# Altium schematic sheet 1_PWR.SchDoc: SmartHalo - Power Supply
size B; Author: Sébastien Gélinas; Organization: SmartHalo; Address1: 5445 de Gaspé; Address2: Montréal, QC; Address3: Canada; Address4: H2T 3B2; DocumentNumber: 1; Revision: 1; SheetNumber: 1; SheetTotal: 7
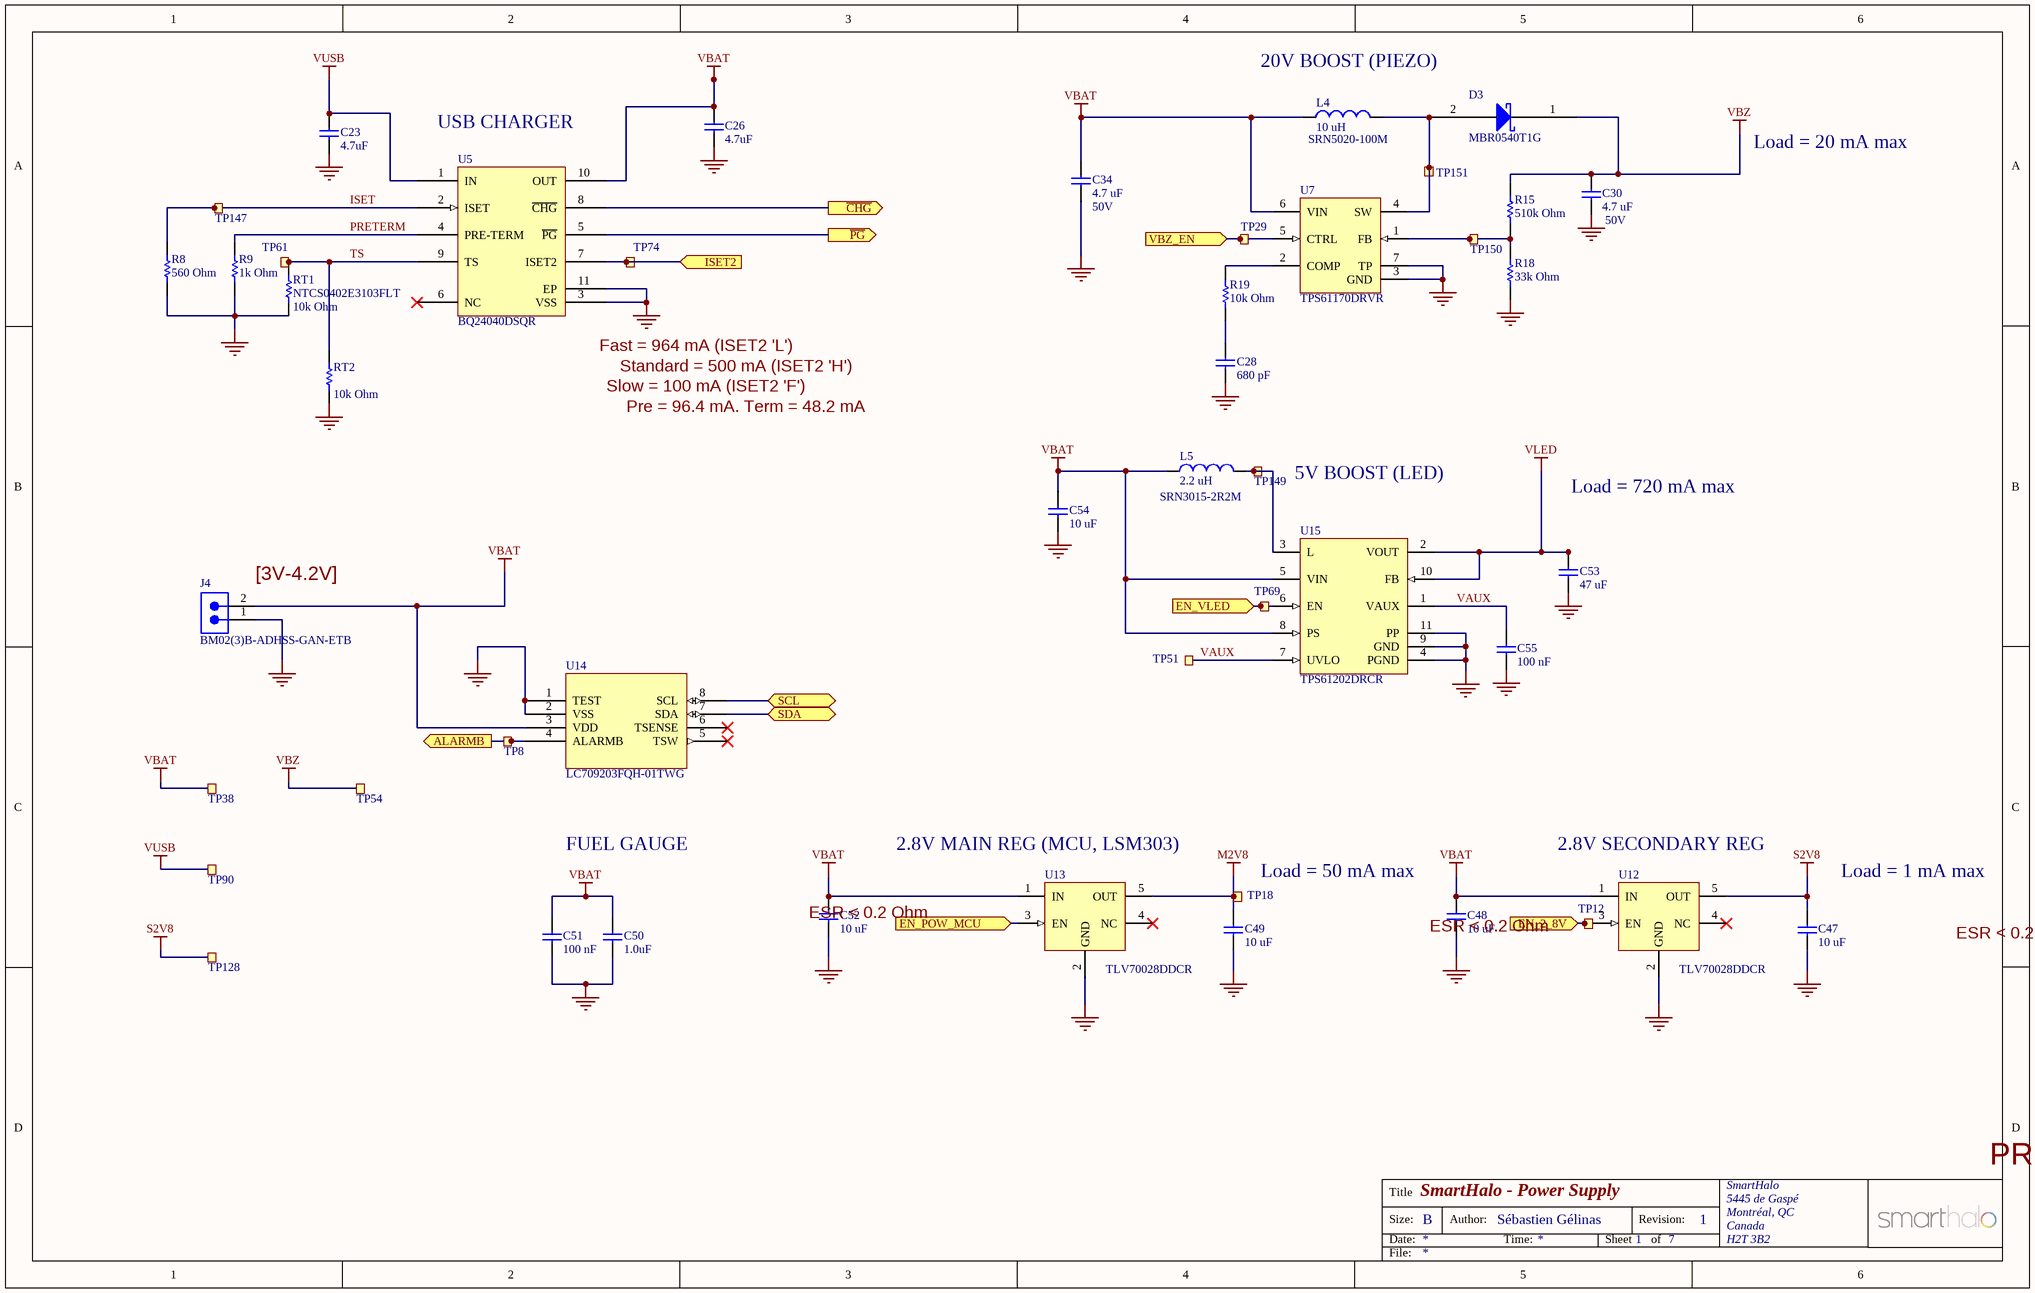
[diagram p0: 1_PWR.SchDoc]

## Parts
C23  4.7uF  [Varitron_CAP0603]
C26  4.7uF  [Varitron_CAP0603]
C28  680 pF  [Varitron_CAP0402]
C30  4.7 uF  Voltage Rating: 50V  [Varitron_CAP0805]
C34  4.7 uF  Voltage Rating: 50V  [Varitron_CAP0805]
C47  10 uF  [Varitron_CAP0805]
C48  10 uF  [Varitron_CAP0805]
C49  10 uF  [Varitron_CAP0805]
C50  1.0uF  [Varitron_CAP0603]
C51  100 nF  [Varitron_CAP0402]
C52  10 uF  [Varitron_CAP0805]
C53  47 uF  [Varitron_CAP1206]
C54  10 uF  [Varitron_CAP0805]
C55  100 nF  [Varitron_CAP0402]
D3  MBR0540T1G  [ONSC-SOD-123-2-425-04_V]
J4  BM02(3)B-ADHSS-GAN-ETB  [BM02(3)B-ADHSS-GAN-ETB]
L4  10 uH  [SRN5020-100M]
L5  2.2 uH  [SRN3015-2R2M]
R8  560 Ohm  [Varitron_RES0402]
R9  1k Ohm  [Varitron_RES0402]
R15  510k Ohm  [Varitron_RES0402]
R18  33k Ohm  [Varitron_RES0402]
R19  10k Ohm  [Varitron_RES0402]
RT1  NTCS0402E3103FLT  value 10k Ohm  [Varitron_RES0402]
RT2  value 10k Ohm  [THERMISTOR_TH]  (no BOM)
TP8  (no value)  [TESTPAD-TH-35mils]  (no BOM)
TP12  (no value)  [TESTPAD-TH-35mils]  (no BOM)
TP18  (no value)  [TESTPAD-TH-1_5mm]  (no BOM)
TP29  (no value)  [TESTPAD-TH-35mils]  (no BOM)
TP38  (no value)  [TESTPAD-TH-35mils]  (no BOM)
TP51  (no value)  [TESTPAD-TH-35mils]  (no BOM)
TP54  (no value)  [TESTPAD-TH-35mils]  (no BOM)
TP61  (no value)  [TESTPAD-TH-35mils]  (no BOM)
TP69  (no value)  [TESTPAD-TH-35mils]  (no BOM)
TP74  (no value)  [TESTPAD-TH-35mils]  (no BOM)
TP90  (no value)  [TESTPAD-TH-35mils]  (no BOM)
TP128  (no value)  [TESTPAD-TH-1_5mm]  (no BOM)
TP147  TP  [TESTPAD-TH-35mils]  (value not drawn)  (no BOM)
TP149  TP  [TESTPAD-TH-35mils]  (value not drawn)  (no BOM)
TP150  TP  [TESTPAD-TH-35mils]  (value not drawn)  (no BOM)
TP151  TP  [TESTPAD-TH-35mils]  (value not drawn)  (no BOM)
U5  BQ24040DSQR  [DSQ10-1500X900TP]
U7  TPS61170DRVR  [DRV6-1600X1000TP]
U12  TLV70028DDCR  [SOT23-5_N]
U13  TLV70028DDCR  [SOT23-5_N]
U14  LC709203FQH-01TWG  [WDFN8]
U15  TPS61202DRCR  [DRC10-2400X1650TP]

## Ports
ALARMB (out), EN_2_8V (in), EN_POW_MCU (in), EN_VLED (in), ISET2 (in), SCL (bidir), SDA (bidir), VBZ_EN (in), ~{CHG} (out), ~{PG} (out)

## Nets
GND: C23.2 C26.2 C28.2 C30.2 C34.2 C47.2 C48.2 C49.2 C50.2 C51.2 C52.2 C53.2 C54.2 C55.2 J4.0(ASSY) J4.1 R8.2 R9.2 R18.1 RT1.1 RT2.1 U5.3(VSS) U5.11(EP) U7.3(GND) U7.7(TP) U12.2(GND) U13.2(GND) U14.1(TEST) U14.2(VSS) U15.4(PGND) U15.9(GND) U15.11(PP)
M2V8: C49.1 TP18.1 U13.5(OUT)
S2V8: C47.1 TP128.1 U12.5(OUT)
VBAT: C26.1 C34.1 C48.1 C50.1 C51.1 C52.1 C54.1 J4.2 L4.1 L5.1 TP38.1 U5.10(OUT) U7.6(VIN) U12.1(IN) U13.1(IN) U14.3(VDD) U15.5(VIN) U15.8(PS)
VBZ: C30.1 D3.1(Cathode) R15.2 TP54.1
VLED: C53.1 U15.2(VOUT) U15.10(FB)
VUSB: C23.1 TP90.1 U5.1(IN)
ALARMB: TP8.1 U14.4(ALARMB) ; port ALARMB
~{CHG}: U5.8(~{CHG}) ; port ~{CHG}
EN_2_8V: TP12.1 U12.3(EN) ; port EN_2_8V
EN_POW_MCU: U13.3(EN) ; port EN_POW_MCU
EN_VLED: TP69.1 U15.6(EN) ; port EN_VLED
ISET: R8.1 TP147.1 U5.2(ISET)
ISET2: TP74.1 U5.7(ISET2) ; port ISET2
~{PG}: U5.5(~{PG}) ; port ~{PG}
PRETERM: R9.1 U5.4(PRE-TERM)
SCL: U14.8(SCL) ; port SCL
SDA: U14.7(SDA) ; port SDA
TS: RT1.2 RT2.2 TP61.1 U5.9(TS)
VAUX: C55.1 TP51.1 U15.1(VAUX) U15.7(UVLO)
VBZ_EN: TP29.1 U7.5(CTRL) ; port VBZ_EN
NetC28_1: C28.1 R19.2
NetD3_2: D3.2(Anode) L4.2 TP151.1 U7.4(SW)
NetL5_2: L5.2 TP149.1 U15.3(L)
NetR15_1: R15.1 R18.2 TP150.1 U7.1(FB)
NetR19_1: R19.1 U7.2(COMP)

Not connected (* = marked no-connect by the designer): U5 6(NC)*; U12 4(NC)*; U13 4(NC)*; U14 5(TSW)* 6(TSENSE)*

## Notes on the sheet
- 20V BOOST (PIEZO)
- (near U5) USB CHARGER
- Load = 20 mA max
- (near U5) Fast = 964 mA (ISET2 'L')
- Standard = 500 mA (ISET2 'H')
- Slow = 100 mA (ISET2 'F')
- (near RT2) Pre = 96.4 mA. Term = 48.2 mA
- 5V BOOST (LED)
- Load = 720 mA max
- (near J4) [3V-4.2V]
- FUEL GAUGE
- (near U13) 2.8V MAIN REG (MCU, LSM303)
- (near TP18) Load = 50 mA max
- (near U12) 2.8V SECONDARY REG
- Load = 1 mA max
- (near C52) ESR < 0.2 Ohm
- (near C48) ESR < 0.2 Ohm
- (near C47) ESR < 0.2 Ohm
- PRELIMINARY: DO NOT USE FOR PRODUCTION
- Title
- Size:
- Date:
- B
- Author:
- Time:
- Sheet
- Revision:
- of
- File:

## Library data of the parts
C23 C26 = Varitron_CAP0603: 4.7uF 10V X7R 10% 0603 (1608 Metric)  SMD; Case-EIA: 0603; Case-Metric: 1608; Tolerance: 10%; Technology: SMT; Temperature Coefficient: X7R; Voltage Rating: 10V; Value: 4.7uF
C28 = Varitron_CAP0402: 680 pF 10V X7R 10% 0402 (1005 Metric)  SMD; Case-EIA: 0402; Case-Metric: 1005; Tolerance: 10%; Technology: SMT; Temperature Coefficient: X7R; Voltage Rating: 10V; Value: 680 pF
C30 C34 = Varitron_CAP0805: 4.7 uF 50V X5R 10% 0805 (2012 Metric)  SMD; Case-EIA: 0805; Case-Metric: 2012; Tolerance: 10%; Technology: SMT; Temperature Coefficient: X5R; Value: 4.7 uF
C47-C49 C52 C54 = Varitron_CAP0805: 10 uF 10V X7R 10% 0805 (2012 Metric)  SMD; Case-EIA: 0805; Case-Metric: 2012; Tolerance: 10%; Technology: SMT; Temperature Coefficient: X7R; Voltage Rating: 10V; Value: 10 uF
C50 = Varitron_CAP0603: 1uF 10V X7R 10% 0603 (1608 Metric)  SMD; Case-EIA: 0603; Case-Metric: 1608; Tolerance: 10%; Technology: SMT; Temperature Coefficient: X7R; Voltage Rating: 10V; Value: 1.0uF
C51 C55 = Varitron_CAP0402: 100 nF 10V X7R 10% 0402 (1005 Metric)  SMD; Case-EIA: 0402; Case-Metric: 1005; Tolerance: 10%; Technology: SMT; Temperature Coefficient: X7R; Voltage Rating: 10V; Value: 100 nF
C53 = Varitron_CAP1206: 47 uF 10V X5R 10% 1206 (3216 Metric)  SMD; Case-EIA: 1206; Case-Metric: 3216; Tolerance: 10%; Technology: SMT; Temperature Coefficient: X5R; Voltage Rating: 10V; Value: 47 uF
D3 = MBR0540T1G: Schottky Power Rectifier, 2-Pin SOD-123, Pb-Free, Tape and Reel; Manufacturer: ON Semiconductor; Manufacturer Part Number: MBR0540T1G; Part Number: MBR0540T1G
J4 = BM02(3)B-ADHSS-GAN-ETB: Connector, 1.3 mm pitch; Manufacturer: JST; Manufacturer Part Number: BM02(3)B-ADHSS-GAN-ETB; Part Number: BM02(3)B-ADHSS-GAN-ETB
L4 = SRN5020-100M: Inductor, 10 uH, 20%, 144 mOhm DCR, 1.3A; Manufacturer: Bourns; Manufacturer Part Number: SRN5020-100M; Part Number: SRN5020-100M; Value: 10 uH; Tolerance: 20%; DCR: 144 mOhm; Saturation Current: 1.3A
L5 = SRN3015-2R2M: Inductor, 2.2 uH, 20%, 72 mOhm DCR, 1.65A; Manufacturer: Bourns; DCR: 72 mOhm; Manufacturer Part Number: SRN3015-2R2M; Part Number: SRN3015-2R2M; Value: 2.2 uH; Tolerance: 20%; Saturation Current: 1.65A
R8 = Varitron_RES0402: 560R 0.063W 5% 0402 (1005 Metric) SMD; Case-Metric: 1005; Case-EIA: 0402; Tolerance: 5%; Technology: SMT; Power: 0.063W; Value: 560 Ohm
R9 = Varitron_RES0402: 1K 0.063W 5%  0402 (1005 Metric)  SMD; Case-Metric: 1005; Case-EIA: 0402; Tolerance: 5%; Technology: SMT; Power: 0.063W; Value: 1k Ohm
R15 = Varitron_RES0402: 510K 0.063W 5% 0402 (1005 Metric)  SMD; Case-Metric: 1005; Case-EIA: 0402; Tolerance: 5%; Technology: SMT; Power: 0.063W; Value: 510k Ohm
R18 = Varitron_RES0402: 33K 0.063W 5%  0402 (1005 Metric)  SMD; Case-Metric: 1005; Case-EIA: 0402; Tolerance: 5%; Technology: SMT; Power: 0.063W; Value: 33k Ohm
R19 = Varitron_RES0402: 10K 0.063W 5% 0402 (1005 Metric)  SMD; Case-Metric: 1005; Case-EIA: 0402; Tolerance: 5%; Technology: SMT; Power: 0.063W; Value: 10k Ohm
RT1 = NTCS0402E3103FLT: Thermistor NTC 0402, R0 10k, 1%, B 3490, SMD; Manufacturer: Vishay; Case-Metric: 1005; Case-EIA: 0402; Beta: 3490; Tolerance: 1%; Technology: SMT; Part Number: NTCS0402E3103FLT; Manufacturer Part Number: NTCS0402E3103FLT
RT2 = THERMISTOR_TH: Thermistor NTC TH, R0 10k, 1%, B , TH; Tolerance: 1%; Technology: TH
TP8 TP12 TP29 TP38 TP51 TP54 TP61 TP69 TP74 TP90 = TESTPAD_TH_35mils: Testpoint, through hole, 35 mils; Value: TP
TP18 TP128 = TESTPAD_TH_1_5MM: Testpoint, through hole, 1.5mm; Value: TP
TP147 TP149-TP151 = TESTPAD_TH_35mils: Testpoint, through hole, 35 mils; Value: TP
U5 = BQ24040DSQR: 800 mA, Single-Input, Single Cell Li-Ion Battery Charger with Auto Start. Vovp=6.6 V, 3.5 V, -40 to 85 degC, 10-pin SON (DSQ), Green (RoHS & no Sb/Br); Manufacturer: Texas Instruments; Manufacturer Part Number: BQ24040DSQR; Part Number: BQ24040DSQR
U7 = TPS61170DRVR: Boost Voltage Converter with 3 to 18 V Input and 3 to 38 V Output, -40 to 85 degC, 6-Pin SON (DRC), Green (RoHS & no Sb/Br); Manufacturer: Texas Instruments; Part Number: TPS61170DRVR; Manufacturer Part Number: TPS61170DRVR
U12 U13 = TLV70028DDCR: Boost Voltage Converter with 3 to 18 V Input and 3 to 38 V Output, -40 to 85 degC, 6-Pin SON (DRC), Green (RoHS & no Sb/Br); Manufacturer: Texas Instruments; Part Number: TLV70028DDCR; Manufacturer Part Number: TLV70028DDCR
U14 = LC709203FQH-01TWG: Smart LiB Gauge, Battery Fuel Gauge LSI for 1-Cell Lithium-ion (Li+); Manufacturer: ON Semiconductor; Manufacturer Part Number: LC709203FQH-01TWG; Part Number: LC709203FQH-01TWG
U15 = TPS61202DRCR: Boost Voltage Converter with 0.3 to 5.5 V Input and 5 V Output, -40 to 85 degC, 10-Pin SON (DRC), Green (RoHS & no Sb/Br); Manufacturer: Texas Instruments; Part Number: TPS61202DRCR; Manufacturer Part Number: TPS61202DRCR